# Altium schematic sheet PT100.SchDoc
size A4; PageSetup: Record=PageOptions|CenterHorizontal=True|CenterVertical=True|PrintScale=0.99|XCorrection=1.00|YCorrection=1.00|PrintKind=1|BorderSize=5000000|LeftOffset=0|BottomOffset=0|Orientation=1|PaperLength=1000|PaperWidth=1000|Scale=100|PaperSource=15|PrintQuality=600|MediaType=1|DitherType=10|PrintScaleMode=1|PaperKind=A4|PaperIndex=9
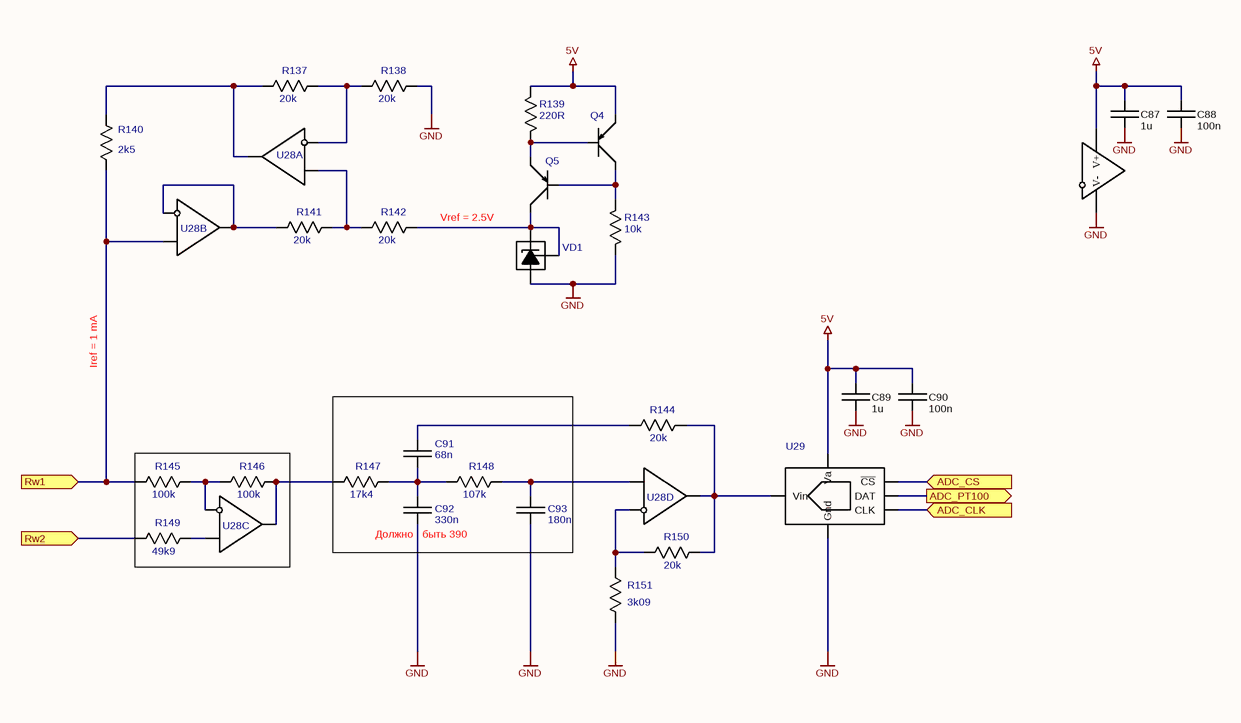
[diagram p0: PT100.SchDoc]

## Parts
C87  1u  [CAP CER 0603 NP]
C88  100n  [CAP CER 0603 NP]
C89  1u  [CAP CER 0603 NP]
C90  100n  [CAP CER 0603 NP]
C91  68n  [CAP CER 0603 NP]
C92  330n  [CAP CER 0603 NP]
C93  180n  [CAP CER 0603 NP]
Q4  PNP Bipolar Transistor  [SOT-23]  (value not drawn)
Q5  PNP Bipolar Transistor  [SOT-23]  (value not drawn)
R137  20k  [RES 0603]
R138  20k  [RES 0603]
R139  220R  [RES 0603]
R140  2k5  [RES 0603]
R141  20k  [RES 0603]
R142  20k  [RES 0603]
R143  10k  [RES 0603]
R144  20k  [RES 0603]
R145  100k  [RES 0603]
R146  100k  [RES 0603]
R147  17k4  [RES 0603]
R148  107k  [RES 0603]
R149  49k9  [RES 0603]
R150  20k  [RES 0603]
R151  3k09  [RES 0603]
U28  OpAmp x4 Small  (value not drawn)  (parts A,B,C,D,E of 5)
U29  SAR ADC  [SOT-23-6]  (value not drawn)
VD1  Zenner Diode Adjustable  [SOT-23]  (value not drawn)

## Blocks framed on the sheet
Должно   быть 390: C91-C93 R147 R148

## Ports
ADC_CLK, ADC_CS, ADC_PT100, Rw1, Rw2

## Nets
5V: C87.1 C88.1 C89.1 C90.1 Q4.2(E) R139.2 U28.13(V+) U29.1(Va)
GND: C87.2 C88.2 C89.2 C90.2 C92.1 C93.1 R138.2 R143.1 R151.1 U28.14(V-) U29.2(Gnd) VD1.1(A)
ADC_CLK: U29.4(CLK) ; port ADC_CLK
ADC_CS: U29.6(~{CS}) ; port ADC_CS
ADC_PT100: U29.5(DAT) ; port ADC_PT100
Rw1: R140.1 R145.1 U28.4(+IN) ; port Rw1
Rw2: R149.1 ; port Rw2
NetC91_1: C91.1 C92.2 R147.2 R148.1
NetC91_2: C91.2 R144.1
NetC93_2: C93.2 R148.2 U28.10(+IN)
NetQ4_1: Q4.1(B) Q5.2(E) R139.1
NetQ4_3: Q4.3(C) Q5.1(B) R143.2
NetQ5_3: Q5.3(C) R142.2 VD1.2(C) VD1.3(Ref)
NetR137_1: R137.1 R140.2 U28.3(OUT1)
NetR137_2: R137.2 R138.1 U28.2(-IN1)
NetR141_1: R141.1 U28.5(-IN) U28.6(OUT)
NetR141_2: R141.2 R142.1 U28.1(+IN1)
NetR144_2: R144.2 R150.2 U28.12(OUT) U29.3(Vin)
NetR145_2: R145.2 R146.1 U28.8(-IN)
NetR146_2: R146.2 R147.1 U28.9(OUT)
NetR149_2: R149.2 U28.7(+IN)
NetR150_1: R150.1 R151.2 U28.11(-IN)

## Notes on the sheet
- Vref = 2.5V
- Iref = 1 mA

## Library data of the parts
C87 C89 = Capacitor: CC0603KRX5R7BB105
C88 C90 = Capacitor: CC0603KRX7R9BB104
C91 = Capacitor: CC0603JRX7R9BB683
C92 = Capacitor: CC0603KRX5R8BB334
C93 = Capacitor: GRM188R71E184KA88D
Q4 Q5 = Bipolar PNP: BC857
R137 R138 R141 R142 = Resistor: RT0603BRD0720KL
R139 = Resistor: RT0603BRD07220RL
R140 = Resistor: AR03BTC2501
R143 = Resistor: RT0603BRD0710KL
R144 R150 = Resistor: RC0603FR-0720KL
R145 R146 = Resistor: RC0603FR-07100KL
R147 = Resistor: RC0603FR-0717K4L
R148 = Resistor: RC0603FR-07107KL
R149 = Resistor: RC0603FR-0749K9L
R151 = Resistor: RC0603FR-073K09L
U28 = OpAmp x4 Small: LMV324IDT
U29 = ADC121: ADC121S021CIMF
VD1 = TL431: TL431ACDBZR; pin to pad: 1>3 2>1 3>2